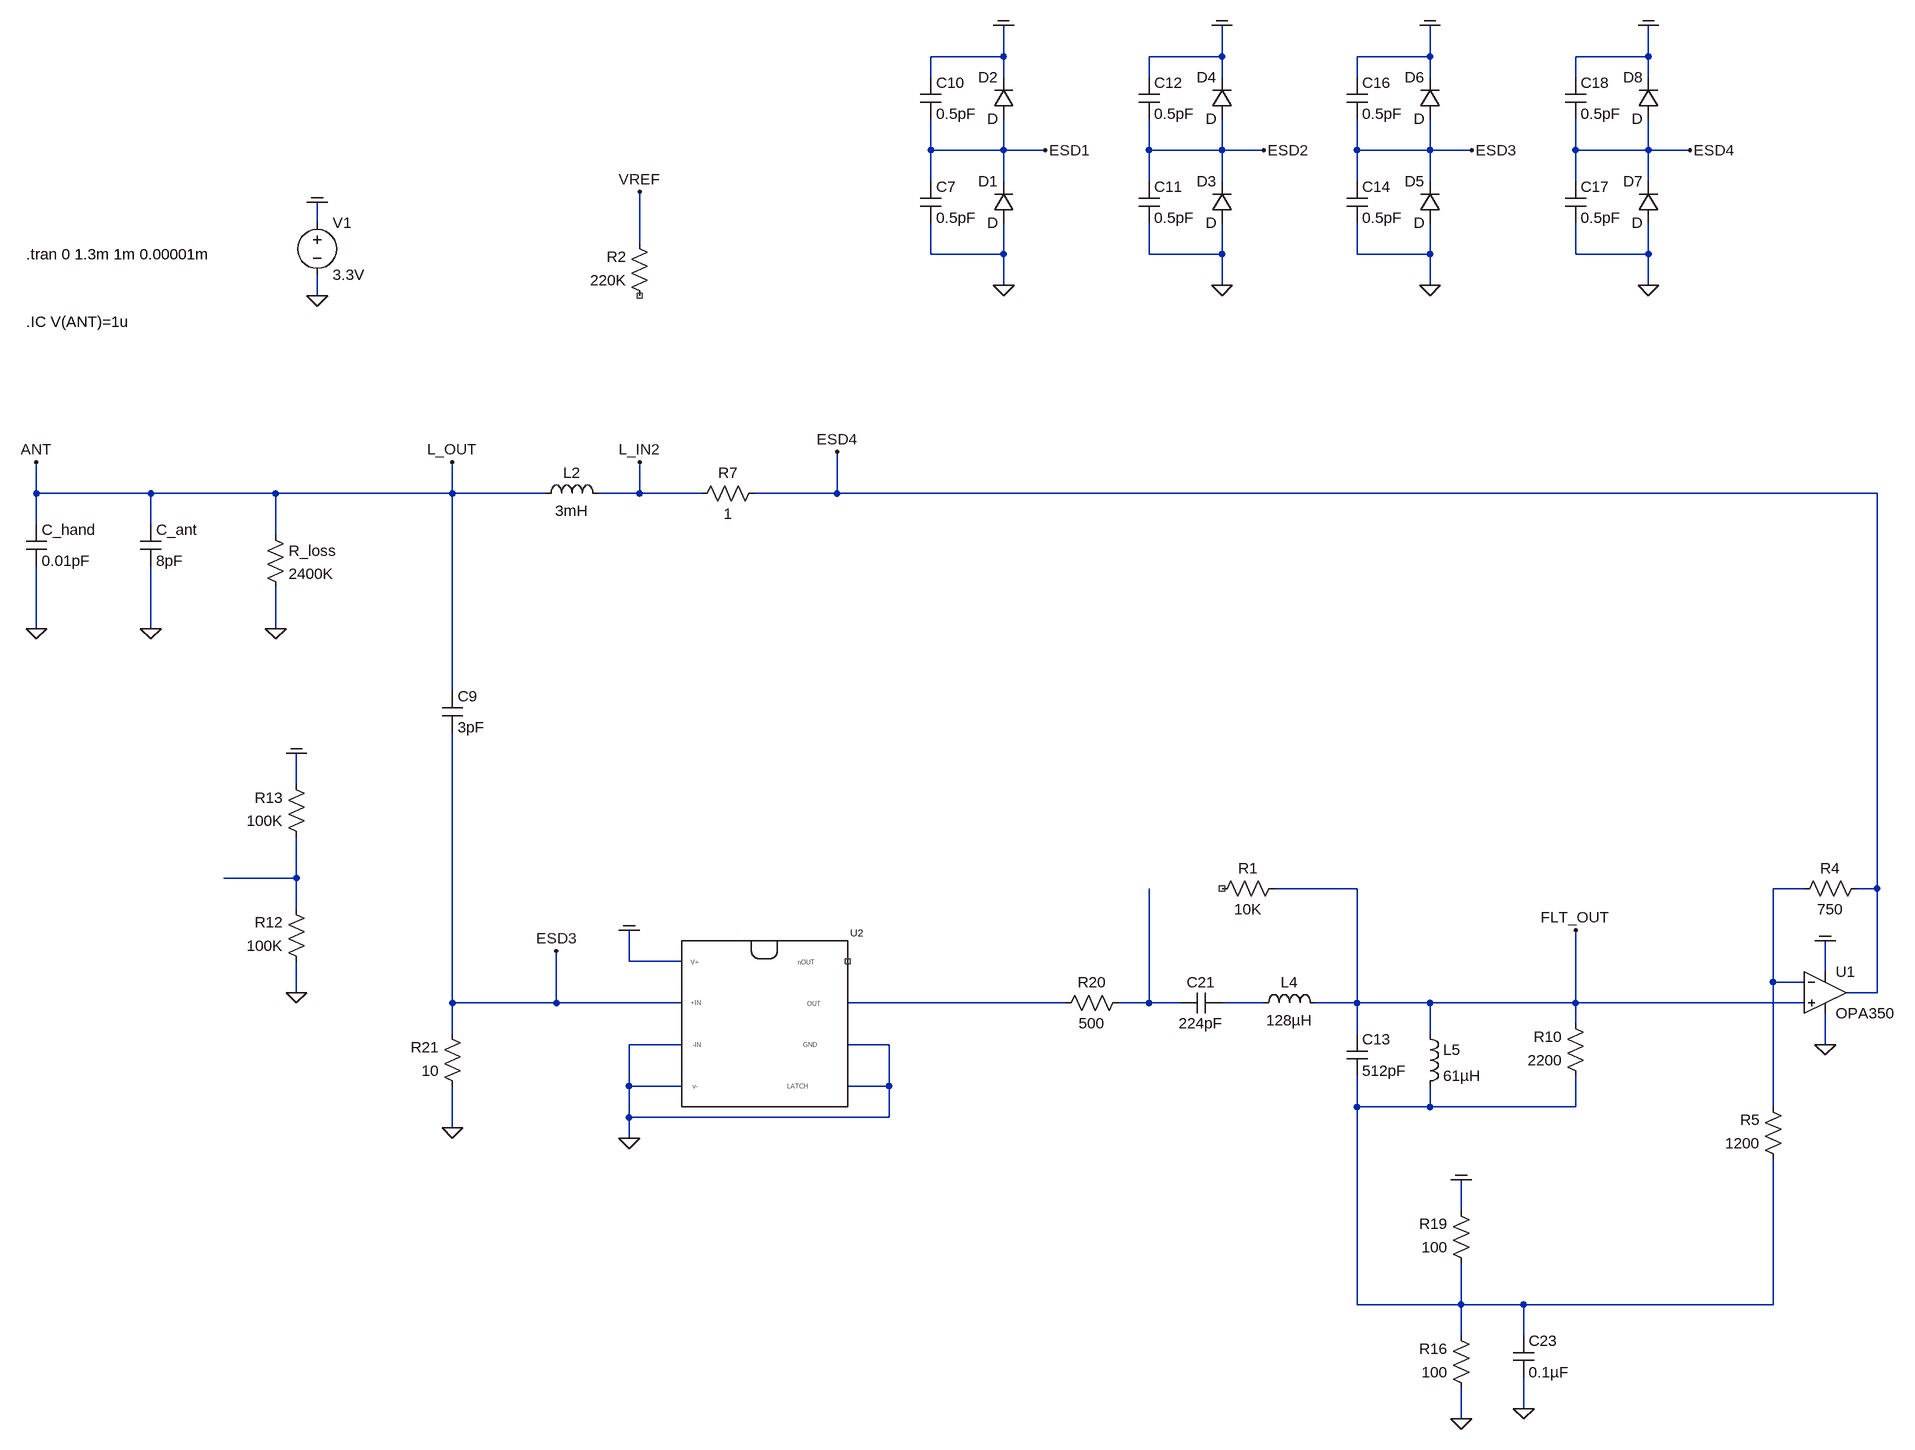
[diagram p0: schematic 2020_oscillator_experiments_v11.asc]
2020_oscillator_experiments_v11.asc, the LTspice schematic file:
Version 4
SHEET 1 3244 3076
WIRE 1056 -176 1056 -224
WIRE 1056 -176 944 -176
WIRE 1392 -176 1392 -224
WIRE 1392 -176 1280 -176
WIRE 1712 -176 1712 -224
WIRE 1712 -176 1600 -176
WIRE 2048 -176 2048 -224
WIRE 2048 -176 1936 -176
WIRE 944 -144 944 -176
WIRE 1056 -144 1056 -176
WIRE 1280 -144 1280 -176
WIRE 1392 -144 1392 -176
WIRE 1600 -144 1600 -176
WIRE 1712 -144 1712 -176
WIRE 1936 -144 1936 -176
WIRE 2048 -144 2048 -176
WIRE 944 -32 944 -80
WIRE 1056 -32 1056 -80
WIRE 1056 -32 944 -32
WIRE 1120 -32 1056 -32
WIRE 1280 -32 1280 -80
WIRE 1392 -32 1392 -80
WIRE 1392 -32 1280 -32
WIRE 1456 -32 1392 -32
WIRE 1600 -32 1600 -80
WIRE 1712 -32 1712 -80
WIRE 1712 -32 1600 -32
WIRE 1776 -32 1712 -32
WIRE 1936 -32 1936 -80
WIRE 2048 -32 2048 -80
WIRE 2048 -32 1936 -32
WIRE 2112 -32 2048 -32
WIRE 944 16 944 -32
WIRE 1056 16 1056 -32
WIRE 1280 16 1280 -32
WIRE 1392 16 1392 -32
WIRE 1600 16 1600 -32
WIRE 1712 16 1712 -32
WIRE 1936 16 1936 -32
WIRE 2048 16 2048 -32
WIRE 0 80 0 48
WIRE 496 112 496 32
WIRE 944 128 944 80
WIRE 1056 128 1056 80
WIRE 1056 128 944 128
WIRE 1280 128 1280 80
WIRE 1392 128 1392 80
WIRE 1392 128 1280 128
WIRE 1600 128 1600 80
WIRE 1712 128 1712 80
WIRE 1712 128 1600 128
WIRE 1936 128 1936 80
WIRE 2048 128 2048 80
WIRE 2048 128 1936 128
WIRE 1056 176 1056 128
WIRE 1392 176 1392 128
WIRE 1712 176 1712 128
WIRE 2048 176 2048 128
WIRE 0 192 0 160
WIRE -432 496 -432 448
WIRE -256 496 -432 496
WIRE -64 496 -256 496
WIRE 208 496 208 448
WIRE 208 496 -64 496
WIRE 352 496 208 496
WIRE 496 496 496 448
WIRE 496 496 432 496
WIRE 592 496 496 496
WIRE 800 496 800 432
WIRE 800 496 672 496
WIRE 2400 496 800 496
WIRE -432 544 -432 496
WIRE -256 544 -256 496
WIRE -64 560 -64 496
WIRE -432 704 -432 608
WIRE -256 704 -256 608
WIRE -64 704 -64 640
WIRE 208 800 208 496
WIRE -32 944 -32 896
WIRE -32 1088 -32 1024
WIRE -32 1088 -144 1088
WIRE 1600 1104 1472 1104
WIRE 2288 1104 2240 1104
WIRE 2400 1104 2400 496
WIRE 2400 1104 2368 1104
WIRE -32 1136 -32 1088
WIRE 480 1216 480 1168
WIRE 560 1216 480 1216
WIRE 2320 1232 2320 1184
WIRE 2240 1248 2240 1104
WIRE 2288 1248 2240 1248
WIRE -32 1264 -32 1216
WIRE 2400 1264 2400 1104
WIRE 2400 1264 2352 1264
WIRE 208 1280 208 864
WIRE 368 1280 368 1200
WIRE 368 1280 208 1280
WIRE 560 1280 368 1280
WIRE 1152 1280 816 1280
WIRE 1280 1280 1280 1104
WIRE 1280 1280 1232 1280
WIRE 1328 1280 1280 1280
WIRE 1456 1280 1392 1280
WIRE 1600 1280 1600 1104
WIRE 1600 1280 1536 1280
WIRE 1712 1280 1600 1280
WIRE 1936 1280 1936 1168
WIRE 1936 1280 1712 1280
WIRE 2288 1280 1936 1280
WIRE 1936 1312 1936 1280
WIRE 208 1328 208 1280
WIRE 1600 1328 1600 1280
WIRE 1712 1328 1712 1280
WIRE 560 1344 480 1344
WIRE 880 1344 816 1344
WIRE 2320 1344 2320 1296
WIRE 480 1408 480 1344
WIRE 560 1408 480 1408
WIRE 880 1408 880 1344
WIRE 880 1408 816 1408
WIRE 1600 1440 1600 1392
WIRE 1712 1440 1712 1408
WIRE 1712 1440 1600 1440
WIRE 1936 1440 1936 1392
WIRE 1936 1440 1712 1440
WIRE 2240 1440 2240 1248
WIRE 480 1456 480 1408
WIRE 880 1456 880 1408
WIRE 880 1456 480 1456
WIRE 208 1472 208 1408
WIRE 480 1488 480 1456
WIRE 1760 1600 1760 1552
WIRE 1600 1744 1600 1440
WIRE 1760 1744 1760 1680
WIRE 1760 1744 1600 1744
WIRE 1856 1744 1760 1744
WIRE 2240 1744 2240 1520
WIRE 2240 1744 1856 1744
WIRE 1760 1792 1760 1744
WIRE 1856 1792 1856 1744
WIRE 1856 1904 1856 1856
WIRE 1760 1920 1760 1872
FLAG 0 192 0
FLAG 0 48 COM
FLAG 496 32 VREF
FLAG 1056 176 0
FLAG 1056 -224 COM
FLAG 1120 -32 ESD1
FLAG 1392 176 0
FLAG 1392 -224 COM
FLAG 1456 -32 ESD2
FLAG -432 448 ANT
FLAG -432 704 0
FLAG -256 704 0
FLAG -64 704 0
FLAG 496 448 L_IN2
FLAG 208 448 L_OUT
FLAG 208 1472 0
FLAG -32 1264 0
FLAG -32 896 COM
FLAG 368 1200 ESD3
FLAG 1712 176 0
FLAG 1712 -224 COM
FLAG 1776 -32 ESD3
FLAG 2048 176 0
FLAG 2048 -224 COM
FLAG 2112 -32 ESD4
FLAG 480 1488 0
FLAG 480 1168 COM
FLAG 1936 1168 FLT_OUT
FLAG 800 432 ESD4
FLAG 1760 1920 0
FLAG 1760 1552 COM
FLAG 1856 1904 0
FLAG 2320 1184 COM
FLAG 2320 1344 0
SYMBOL voltage 0 64 R0
WINDOW 123 0 0 Left 0
WINDOW 39 0 0 Left 0
SYMATTR InstName V1
SYMATTR Value 3.3V
SYMBOL res 512 208 R180
WINDOW 0 36 76 Left 2
WINDOW 3 36 40 Left 2
SYMATTR InstName R2
SYMATTR Value 220K
SYMBOL diode 1072 80 R180
WINDOW 0 24 64 Left 2
WINDOW 3 24 0 Left 2
SYMATTR InstName D1
SYMBOL diode 1072 -80 R180
WINDOW 0 24 64 Left 2
WINDOW 3 24 0 Left 2
SYMATTR InstName D2
SYMBOL cap 928 16 R0
SYMATTR InstName C7
SYMATTR Value 0.5pF
SYMBOL cap 928 -144 R0
SYMATTR InstName C10
SYMATTR Value 0.5pF
SYMBOL diode 1408 80 R180
WINDOW 0 24 64 Left 2
WINDOW 3 24 0 Left 2
SYMATTR InstName D3
SYMBOL diode 1408 -80 R180
WINDOW 0 24 64 Left 2
WINDOW 3 24 0 Left 2
SYMATTR InstName D4
SYMBOL cap 1264 16 R0
SYMATTR InstName C11
SYMATTR Value 0.5pF
SYMBOL cap 1264 -144 R0
SYMATTR InstName C12
SYMATTR Value 0.5pF
SYMBOL ind 336 512 R270
WINDOW 0 32 56 VTop 2
WINDOW 3 5 56 VBottom 2
SYMATTR InstName L2
SYMATTR Value 3mH
SYMATTR SpiceLine Rser=120 Rpar=20Meg
SYMBOL cap -272 544 R0
SYMATTR InstName C_ant
SYMATTR Value 8pF
SYMBOL cap -448 544 R0
SYMATTR InstName C_hand
SYMATTR Value 0.01pF
SYMBOL res -80 544 R0
SYMATTR InstName R_loss
SYMATTR Value 2400K
SYMBOL res 688 480 R90
WINDOW 0 0 56 VBottom 2
WINDOW 3 32 56 VTop 2
SYMATTR InstName R7
SYMATTR Value 1
SYMBOL cap 192 800 R0
SYMATTR InstName C9
SYMATTR Value 3pF
SYMBOL res -16 1232 R180
WINDOW 0 36 76 Left 2
WINDOW 3 36 40 Left 2
SYMATTR InstName R12
SYMATTR Value 100K
SYMBOL res -16 1040 R180
WINDOW 0 36 76 Left 2
WINDOW 3 36 40 Left 2
SYMATTR InstName R13
SYMATTR Value 100K
SYMBOL diode 1728 80 R180
WINDOW 0 24 64 Left 2
WINDOW 3 24 0 Left 2
SYMATTR InstName D5
SYMBOL diode 1728 -80 R180
WINDOW 0 24 64 Left 2
WINDOW 3 24 0 Left 2
SYMATTR InstName D6
SYMBOL cap 1584 16 R0
SYMATTR InstName C14
SYMATTR Value 0.5pF
SYMBOL cap 1584 -144 R0
SYMATTR InstName C16
SYMATTR Value 0.5pF
SYMBOL diode 2064 80 R180
WINDOW 0 24 64 Left 2
WINDOW 3 24 0 Left 2
SYMATTR InstName D7
SYMBOL diode 2064 -80 R180
WINDOW 0 24 64 Left 2
WINDOW 3 24 0 Left 2
SYMATTR InstName D8
SYMBOL cap 1920 16 R0
SYMATTR InstName C17
SYMATTR Value 0.5pF
SYMBOL cap 1920 -144 R0
SYMATTR InstName C18
SYMATTR Value 0.5pF
SYMBOL res 224 1424 R180
WINDOW 0 36 76 Left 2
WINDOW 3 36 40 Left 2
SYMATTR InstName R21
SYMATTR Value 10
SYMBOL cap 1392 1264 R90
WINDOW 0 0 32 VBottom 2
WINDOW 3 32 32 VTop 2
SYMATTR InstName C21
SYMATTR Value 224pF
SYMBOL ind 1440 1296 R270
WINDOW 0 32 56 VTop 2
WINDOW 3 5 56 VBottom 2
SYMATTR InstName L4
SYMATTR Value 128µH
SYMATTR SpiceLine Rser=10
SYMBOL res 1952 1408 R180
WINDOW 0 36 76 Left 2
WINDOW 3 36 40 Left 2
SYMATTR InstName R10
SYMATTR Value 2200
SYMBOL cap 1584 1328 R0
SYMATTR InstName C13
SYMATTR Value 512pF
SYMBOL ind 1696 1312 R0
SYMATTR InstName L5
SYMATTR Value 61µH
SYMATTR SpiceLine Rser=1
SYMBOL res 1776 1888 R180
WINDOW 0 36 76 Left 2
WINDOW 3 36 40 Left 2
SYMATTR InstName R16
SYMATTR Value 100
SYMBOL res 1776 1696 R180
WINDOW 0 36 76 Left 2
WINDOW 3 36 40 Left 2
SYMATTR InstName R19
SYMATTR Value 100
SYMBOL cap 1840 1792 R0
SYMATTR InstName C23
SYMATTR Value 0.1µF
SYMBOL res 1248 1264 R90
WINDOW 0 0 56 VBottom 2
WINDOW 3 32 56 VTop 2
SYMATTR InstName R20
SYMATTR Value 500
SYMBOL res 2272 1120 R270
WINDOW 0 32 56 VTop 2
WINDOW 3 0 56 VBottom 2
SYMATTR InstName R4
SYMATTR Value 750
SYMBOL res 2256 1536 R180
WINDOW 0 36 76 Left 2
WINDOW 3 36 40 Left 2
SYMATTR InstName R5
SYMATTR Value 1200
SYMBOL SBORKA\\OPamp\\OPA350 2320 1264 R0
SYMATTR InstName U1
SYMBOL res 1488 1088 R90
WINDOW 0 0 56 VBottom 2
WINDOW 3 32 56 VTop 2
SYMATTR InstName R1
SYMATTR Value 10K
SYMBOL ad8611 688 1312 R0
SYMATTR InstName U2
TEXT -448 128 Left 2 !.tran 0 1.3m 1m 0.00001m
TEXT -448 232 Left 2 !.IC V(ANT)=1u

The netlist it stands for:
* 2020_oscillator_experiments_v11.asc
V1 COM 0 3.3V
R2 NC_01 VREF 220K
D1 0 ESD1 D
D2 ESD1 COM D
C7 ESD1 0 0.5pF
C10 COM ESD1 0.5pF
D3 0 ESD2 D
D4 ESD2 COM D
C11 ESD2 0 0.5pF
C12 COM ESD2 0.5pF
L2 L_OUT L_IN2 3mH Rser=120 Rpar=20Meg
C_ant L_OUT 0 8pF
C_hand L_OUT 0 0.01pF
R_loss L_OUT 0 2400K
R7 ESD4 L_IN2 1
C9 L_OUT ESD3 3pF
R12 0 N001 100K
R13 N001 COM 100K
D5 0 ESD3 D
D6 ESD3 COM D
C14 ESD3 0 0.5pF
C16 COM ESD3 0.5pF
D7 0 ESD4 D
D8 ESD4 COM D
C17 ESD4 0 0.5pF
C18 COM ESD4 0.5pF
R21 0 ESD3 10
C21 N005 N004 224pF
L4 N005 FLT_OUT 128µH Rser=10
R10 N006 FLT_OUT 2200
C13 FLT_OUT N006 512pF
L5 FLT_OUT N006 61µH Rser=1
R16 0 N006 100
R19 N006 COM 100
C23 N006 0 0.1µF
R20 N004 N003 500
R4 N002 ESD4 750
R5 N006 N002 1200
* U1: OPA350 (symbol SBORKA\OPamp\OPA350 not available, pins judged from their places): In+=FLT_OUT In-=N002 V+=COM V-=0 OUT=ESD4
R1 FLT_OUT NC_02 10K
XU2 ESD3 0 COM 0 0 0 N003 NC_03 ad8611  ; pins +IN -IN V+ V- Latch GND OUT nOUT
.model D D
.lib standard.dio
.tran 0 1.3m 1m 0.00001m
.IC V(ANT)=1u
.lib AD8611.cir
.backanno
.end